# Altium schematic sheet vfd_mcu.SchDoc
size A3
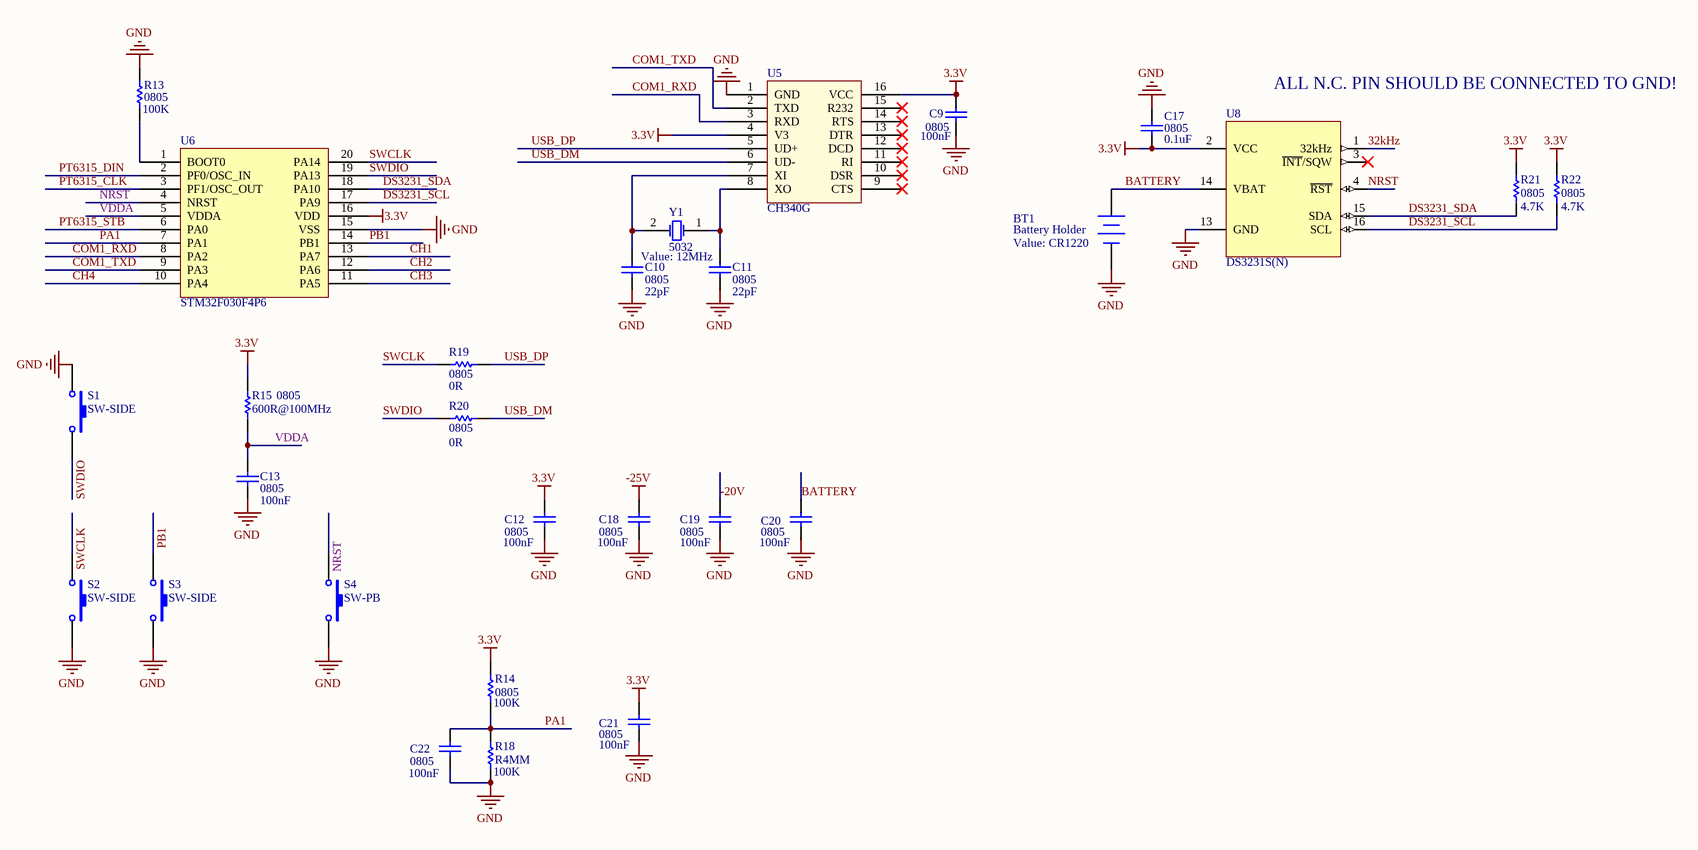
[diagram p0: vfd_mcu.SchDoc]

## Parts
BT1  Battery Holder  value CR1220  [BAT]
C9  0805  value 100nF  [6-0805_N]
C10  0805  value 22pF  [6-0805_N]
C11  0805  value 22pF  [6-0805_N]
C12  0805  value 100nF  [6-0805_N]
C13  0805  value 100nF  [6-0805_N]
C17  0805  value 0.1uF  [6-0805_N]
C18  0805  value 100nF  [6-0805_N]
C19  0805  value 100nF  [6-0805_N]
C20  0805  value 100nF  [6-0805_N]
C21  0805  value 100nF  [6-0805_N]
C22  0805  value 100nF  [6-0805_N]
R13  0805  value 100K  [6-0805_N]
R14  0805  value 100K  [6-0805_N]
R15  0805  value 600R@100MHz  [6-0805_N]
R18  R4MM  value 100K  [R4MM]
R19  0805  value 0R  [6-0805_N]
R20  0805  value 0R  [6-0805_N]
R21  0805  value 4.7K  [6-0805_N]
R22  0805  value 4.7K  [6-0805_N]
S1  SW-SIDE  [SW_SIDE]
S2  SW-SIDE  [SW_SIDE]
S3  SW-SIDE  [SW_SIDE]
S4  SW-PB  [aj3X6]
U5  CH340G  [SOP-16_N]
U6  STM32F030F4P6  [TSSOP20]
U8  DS3231S(N)  [WSO16_N]
Y1  5032  value 12MHz  [4SMX]

## Nets
3.3V: C9.2 C12.2 C17.1 C21.2 R14.1 R15.1 R21.2 R22.2 U5.4(V3) U5.16(VCC) U6.16(VDD) U8.2(VCC)
-25V: C18.2
GND: BT1.2(-) C9.1 C10.1 C11.1 C12.1 C13.1 C17.2 C18.1 C19.1 C20.1 C21.1 C22.1 R13.1 R18.2 S1.1 S2.2 S3.2 S4.2 U5.1(GND) U6.15(VSS) U8.5(N.C.) U8.6(N.C.) U8.7(N.C.) U8.8(N.C.) U8.9(N.C.) U8.10(N.C.) U8.11(N.C.) U8.12(N.C.) U8.13(GND)
32kHz: U8.1(32kHz)
-20V: C19.2
BATTERY: BT1.1(+) C20.2 U8.14(VBAT)
CH1: U6.13(PA7)
CH2: U6.12(PA6)
CH3: U6.11(PA5)
CH4: U6.10(PA4)
COM1_RXD: U5.3(RXD) U6.8(PA2)
COM1_TXD: U5.2(TXD) U6.9(PA3)
DS3231_SCL: R22.1 U6.17(PA9) U8.16(SCL)
DS3231_SDA: R21.1 U6.18(PA10) U8.15(SDA)
NRST: S4.1 U6.4(NRST) U8.4(~{RST})
PA1: C22.2 R14.2 R18.1 U6.7(PA1)
PB1: S3.1 U6.14(PB1)
PT6315_CLK: U6.3(PF1/OSC_OUT)
PT6315_DIN: U6.2(PF0/OSC_IN)
PT6315_STB: U6.6(PA0)
SWCLK: R19.2 S2.1 U6.20(PA14)
SWDIO: R20.2 S1.2 U6.19(PA13)
USB_DM: R20.1 U5.6(UD-)
USB_DP: R19.1 U5.5(UD+)
VDDA: C13.2 R15.2 U6.5(VDDA)
NetC10_2: C10.2 U5.7(XI) Y1.2(OSC2)
NetC11_2: C11.2 U5.8(XO) Y1.1(OSC1)
NetR13_2: R13.2 U6.1(BOOT0)

Not connected (* = marked no-connect by the designer): U5 9(CTS)* 10(DSR)* 11(RI)* 12(DCD)* 13(DTR)* 14(RTS)* 15(R232)*; U8 3(~{INT}/SQW)*

## Notes on the sheet
- ALL N.C. PIN SHOULD BE CONNECTED TO GND!

## Library data of the parts
BT1 = Battery: Multicell Battery; Published: 24-Mar-1999; LatestRevisionDate: 17-Jul-2002; LatestRevisionNote: Re-released for DXP Platform.; PackageReference: BAT-2; Publisher: Altium Limited; PackageDescription: Battery; 2 Leads
C9 C12 C18-C22 = CAP: Capacitor; Published: 8-Jun-2000; Revision: July-2002: Re-released for DXP Platform.; Publisher: Altium Limited
C10 C11 C13 C17 = Cap: Capacitor; Published: 8-Jun-2000; LatestRevisionDate: 17-Jul-2002; LatestRevisionNote: Re-released for DXP Platform.; PackageReference: RAD-0.3; Publisher: Altium Limited; PackageDescription: Radial Cap, Thru-Hole; 2 Leads; 0.3 in Pin Spacing
R13 R15 R21 R22 = Res1: Resistor; Published: 8-Jun-2000; LatestRevisionDate: 17-Jul-2002; LatestRevisionNote: Re-released for DXP Platform.; PackageReference: AXIAL-0.3; Publisher: Altium Limited
  R15 R21 R22: PackageDescription: Axial Device, Thru-Hole; 2 Leads; 0.3 in Pin Spacing
R14 R18-R20 = res1: Resistor; Fitted: NO; Published: 8-Jun-2000; Revision: July-2002: Re-released for DXP Platform.; Publisher: Altium Limited
S1-S4 = SW-PB: Switch; Published: 24-Mar-1999; LatestRevisionDate: 17-Jul-2002; LatestRevisionNote: Re-released for DXP Platform.; PackageReference: SPST-2; Publisher: Altium Limited; PackageDescription: Switch; 2 Leads
U8 = DS3231
Y1 = XTAL: Crystal Oscillator; Published: 8-Jun-2000; LatestRevisionDate: 17-Jul-2002; LatestRevisionNote: Re-released for DXP Platform.; PackageReference: R38; Publisher: Altium Limited